# EAGLE design LPS25HBTR (EAGLE 9.0.0)
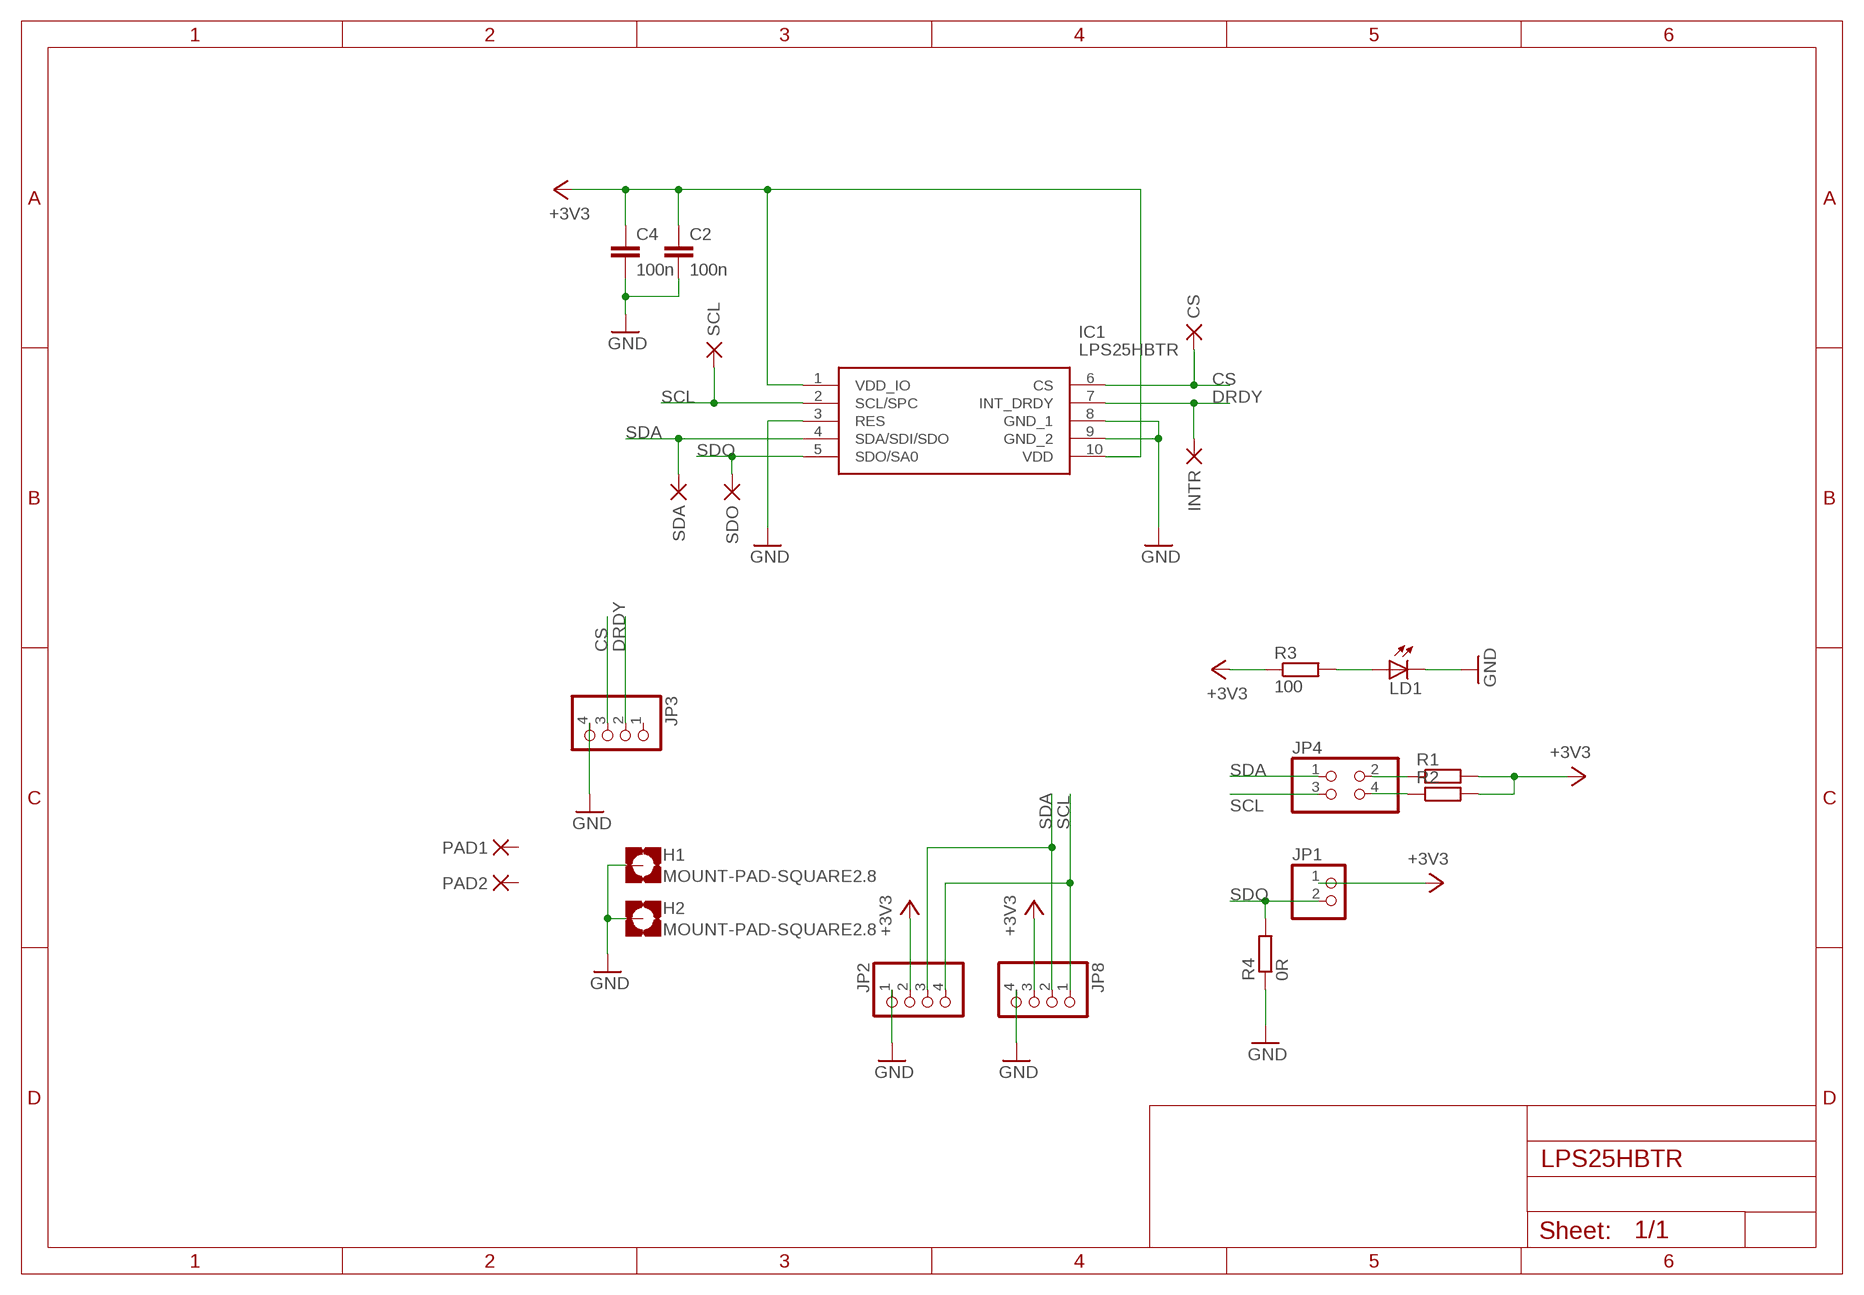
[diagram p0: schematic, sheet 1]

## Parts
C2  100n  C-EUC0805  [C0805]
C4  100n  C-EUC0805  [C0805]
CS  PAD-SMD10R  [SMD10R]
H1  MOUNT-PAD-SQUARE2.8  [2,8-PAD-SQUARE]
H2  MOUNT-PAD-SQUARE2.8  [2,8-PAD-SQUARE]
IC1  LPS25HBTR  [PQFN60P250X250X80-10N]
INTR  PAD-SMD10R  [SMD10R]
JP1  PINHD-1X2  [1X02]
JP2  PINHD-1X4_2.54-90°  [1X04/90]
JP3  PINHD-1X4  [1X04]
JP4  PINHD-2X2_2.54  [2X02]
JP8  PINHD-1X4_2.54-90°  [1X04/90]
LD1  LEDCHIPLED_0805  [CHIPLED_0805]
PAD1  PAD-SMD10R  [SMD10R]
PAD2  PAD-SMD10R  [SMD10R]
R1  R-EU_R0805  [R0805]
R2  R-EU_R0805  [R0805]
R3  100  R-EU_R0805  [R0805]
R4  0R  R-EU_R0805  [R0805]
SCL  PAD-SMD10R  [SMD10R]
SDA  PAD-SMD10R  [SMD10R]
SDO  PAD-SMD10R  [SMD10R]

## Nets
+3V3: C2.1 C4.1 IC1.1(VDD_IO) IC1.10(VDD) JP1.1 JP2.2 JP8.3 R1.2 R2.2 R3.1
CS: CS.PAD(P) IC1.6(CS) JP3.3
DRDY: IC1.7(INT_DRDY) INTR.PAD(P) JP3.2
GND: C2.2 C4.2 H1.B2,8(MOUNT) H2.B2,8(MOUNT) IC1.3(RES) IC1.8(GND_1) IC1.9(GND_2) JP2.1 JP3.4 JP8.4 LD1.C R4.1
N$1: JP4.2 R1.1
N$12: LD1.A R3.2
N$15: JP4.4 R2.1
SCL: IC1.2(SCL/SPC) JP2.4 JP4.3 JP8.1 SCL.PAD(P)
SDA: IC1.4(SDA/SDI/SDO) JP2.3 JP4.1 JP8.2 SDA.PAD(P)
SDO: IC1.5(SDO/SA0) JP1.2 R4.2 SDO.PAD(P)
Unconnected: JP3.1 PAD1.PAD(P) PAD2.PAD(P)

## Library data of the parts
C2 C4 = rcl:C-EU: CAPACITOR, European symbol
CS INTR PAD1 PAD2 SCL SDA SDO = dpads:PAD: WIRE PAD Standard US Drill Sizes and SMD pads
H1 H2 = holes:MOUNT-PAD-SQUARE: MOUNTING PAD, square
IC1 = LPS25HBTR:LPS25HBTR: Board Mount Pressure Sensors HESA MICROSYSTEM Source: Datasheet <http://www.st.com/st-web-ui/static/active/en/resource/technical/document/datasheet/DM00141379.pdf>; DESCRIPTION: Board Mount Pressure Sensors HESA MICROSYSTEM; HEIGHT: 0.8mm; MANUFACTURER_NAME: STMicroelectronics; MANUFACTURER_PART_NUMBER: LPS25HBTR; MOUSER_PART_NUMBER: 511-LPS25HBTR; MOUSER_PRICE-STOCK: https://www.mouser.com/Search/Refine.aspx?Keyword=511-LPS25HBTR; RS_PART_NUMBER: 1106550P; RS_PRICE-STOCK: http://uk.rs-online.com/web/p/products/1106550P
JP1 = pinhead:PINHD-1X2: PIN HEADER
JP2 JP8 = pinhead-1:PINHD-1X4: PIN HEADER
JP3 = pinhead:PINHD-1X4: PIN HEADER
JP4 = pinhead-1:PINHD-2X2: PIN HEADER
LD1 = led:LED: LED OSRAM: - CHIPLED LG R971, LG N971, LY N971, LG Q971, LY Q971, LO R971, LY R971 LH N974, LH R974 LS Q976, LO Q976, LY Q976 LO Q996 - Hyper CHIPLED LW Q18S LB Q993, LB Q99A, LB R99A - SideLED LS A670, LO A670, LY A670, LG A670, LP A670 LB A673, LV A673, LT A673, LW A673 LH A674 LY A675 LS A676, LA A676, LO A676, LY A676, LW A676 LS A679, LY A679, LG A679 - Hyper Micro SIDELED® LS Y876, LA Y876, LO Y876, LY Y876 LT Y87S - SmartLED LW L88C, LW L88S LB L89C, LB L89S, LG L890 LS L89K, LO L89K, LY L89K LS L896, LA L896, LO L896, LY L896 - TOPLED LS T670, LO T670, LY T670, LG T670, LP T670 LSG T670, LSP T670, LSY T670, LOP T670, LYG T670 LG T671, LOG T671, LSG T671 LB T673, LV T673, LT T673, LW T673 LH T674 LS T676, LA T676, LO T676, LY T676, LB T676, LH T676, LSB T676, LW T676 LB T67C, LV T67C, LT T67C, LS T67K, LO T67K, LY T67K, LW E67C LS E67B, LA E67B, LO E67B, LY E67B, LB E67C, LV E67C, LT E67C LW T67C LS T679, LY T679, LG T679 LS T770, LO T770, LY T770, LG T770, LP T770 LB T773, LV T773, LT T773, LW T773 LH T774 LS E675, LA E675, LY E675, LS T675 LS T776, LA T776, LO T776, LY T776, LB T776 LHGB T686 LT T68C, LB T68C - Hyper Mini TOPLED® LB M676 - Mini TOPLED Santana® LG M470 LS M47K, LO M47K, LY M47K Source: http://www.osram.convergy.de/
R1-R4 = rcl:R-EU_: RESISTOR, European symbol

## Board
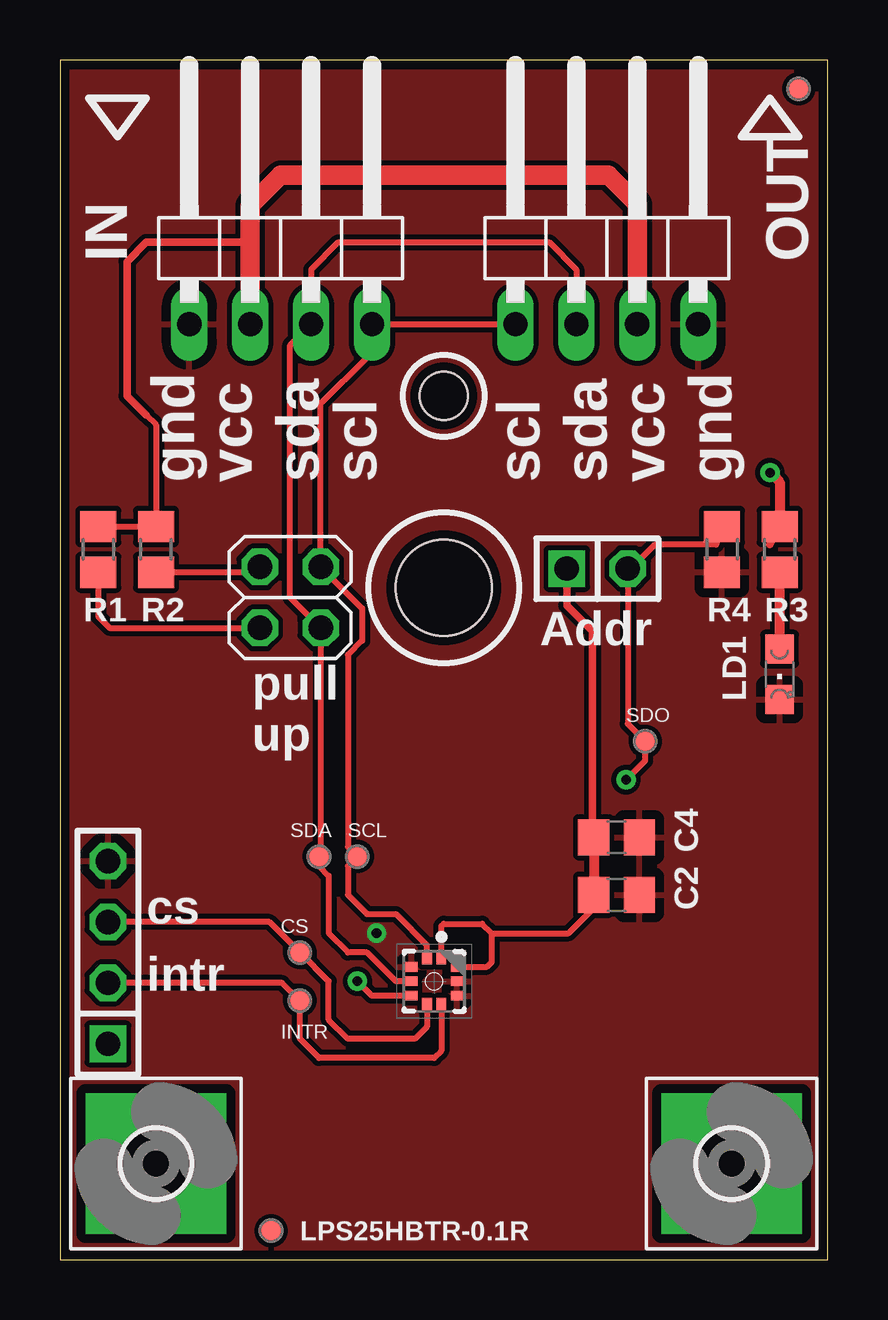
[diagram p1: board, top side]
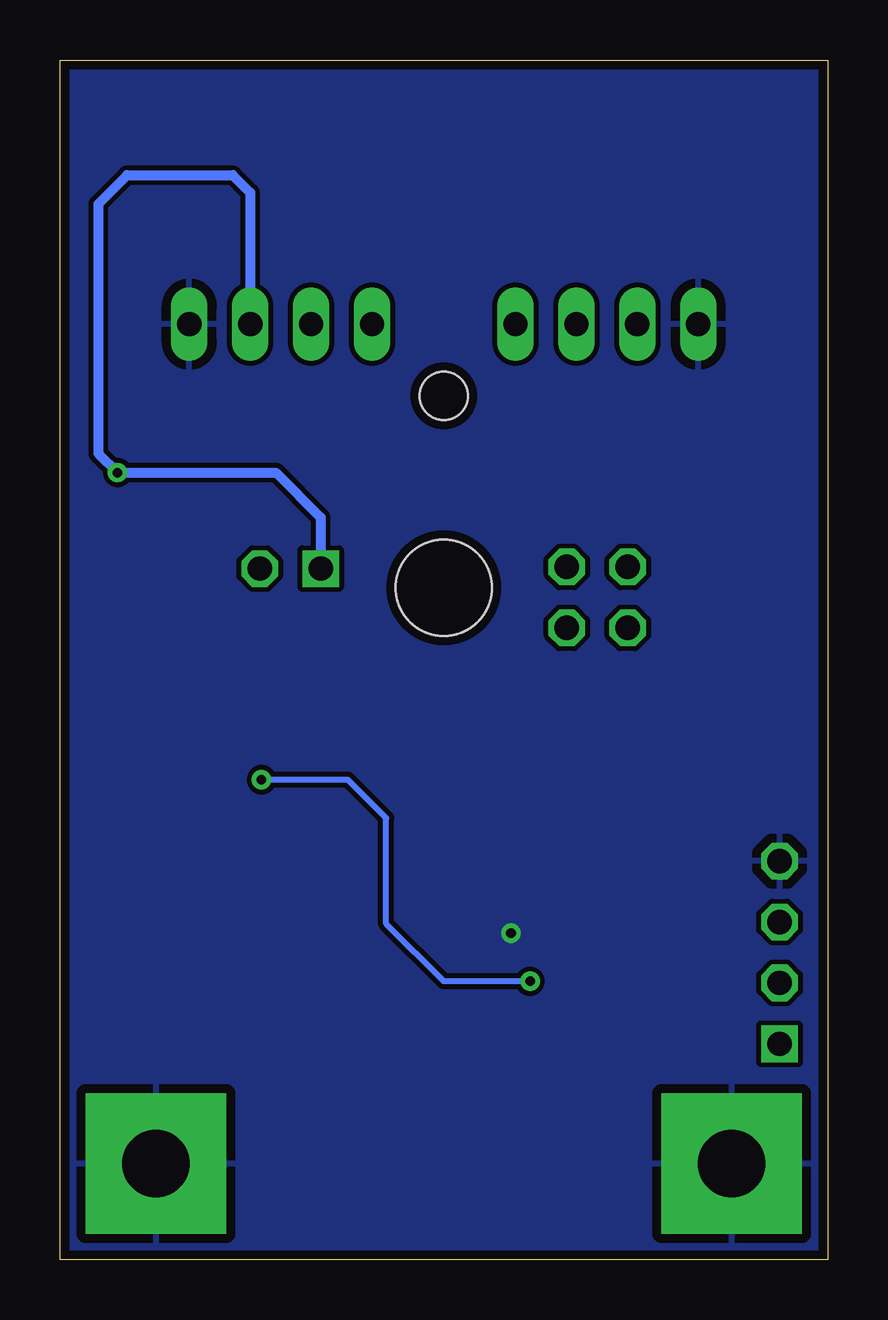
[diagram p2: board, bottom side, seen from below]

Size 32 x 50 mm. Coordinates in mm from the lower left corner, seen from the top.
Outline: 0,0 32,0 32,50 0,50 0,0
Copper layers (1*16): Top 0.035mm / dielectric 1.5mm / Bottom 0.035mm
Design rules "default *": minimum track width 10mil, minimum drill 0.6mm, track to track 8mil, track to pad 8mil, pad to pad 7mil, via to via 8mil, smd to smd 2mil, copper to edge 15mil, drill to drill 10mil, minimum pad ring 10mil, minimum via ring 8mil, stop-mask expansion 4mil, vias tented up to drill 0.6mm, thermal gap 15mil
Holes 2 mm at 16,36
Holes 4 mm at 16,28

### Footprints (pad centres in the part's own frame; a part is rotated, then mirrored left to right if it is on the bottom)
C0805 = smd 1.3 x 1.5: 1 -0.95,0; 2 0.95,0
SMD10R = smd 1 x 1: PAD 0,0
2,8-PAD-SQUARE = drill 2.8 pad 5.842 square: B2,8 0,0
PQFN60P250X250X80-10N = smd 0.5 x 0.4: 1 -0.95,0.3; 2 -0.95,-0.3; 6 0.95,-0.3; 7 0.95,0.3 | smd 0.4 x 0.5: 3 -0.6,-0.95; 4 0,-0.95; 5 0.6,-0.95; 8 0.6,0.95; 9 0,0.95; 10 -0.6,0.95
1X02 = drill 1.016 square: 1 -1.27,0 | drill 1.016 octagon: 2 1.27,0
1X04/90 = drill 1.016 long: 1 -3.81,-3.81; 2 -1.27,-3.81; 3 1.27,-3.81; 4 3.81,-3.81
1X04 = drill 1.016 square: 1 -3.81,0 | drill 1.016 octagon: 2 -1.27,0; 3 1.27,0; 4 3.81,0
2X02 = drill 1.016 octagon: 1 -1.27,-1.27; 2 -1.27,1.27; 3 1.27,-1.27; 4 1.27,1.27
CHIPLED_0805 = smd 1.2 x 1.2: A 0,-1.05; C 0,1.05
R0805 = smd 1.3 x 1.5: 1 -0.95,0; 2 0.95,0

### Placement (x,y rotation side)
C2  23.2,15.2 0 top
C4  23.2,17.6 0 top
CS  10,12.8 0 top
H1  4,4 0 top
H2  28,4 0 top
IC1  15.6,11.6 270 top
INTR  10,10.8 0 top
JP1  22.4,28.8 0 top
JP2  9.2,42.8 0 top
JP3  2,12.8 90 top
JP4  9.6,27.6 90 top
JP8  22.8,42.8 0 top
LD1  30,24.4 180 top
PAD1  8.8,1.2 0 top
PAD2  30.8,48.8 0 top
R1  1.6,29.6 90 top
R2  4,29.6 90 top
R3  30,29.6 270 top
R4  27.6,29.6 90 top
SCL  12.4,16.8 0 top
SDA  10.8,16.8 0 top
SDO  24.4,21.6 0 top

### Tracks (layer width: path | path; a pad name or v marks a point on that pad's centre or on a via)
+3V3  (via drill 0.4)
  Top 0.254: C2.1 22.13,15.13 | 22.13,15.13 22,15 | R1.2 R2.2 4,34.8 3.6,35.2 | IC1.1 15.9,13.9 16,14 17.6,14 18,13.6 | IC1.10 17.8,12.2 18,12.4 18,13.6 | 18,13.6 21.2,13.6 22.13,14.53 22.13,15.13
  Top 0.305: R3.1 29.6,29.8 | 3.6,35.2 2.8,36 2.8,41.6 3.6,42.4 7.93,42.4 | JP1.1 21.13,27.27 22.2,26.2 22.2,17.9 C4.1
  Top 0.406: C4.1 C2.1 | v29.6,32.8 30,32.4 R3.1
  Top 0.813: JP2.2 7.93,42.4 7.93,43.93 9.2,45.2 22.87,45.2 24.07,44 JP8.3
  Bottom 0.406: JP8.3 24.07,44.47 24.8,45.2 29.2,45.2 30.4,44 30.4,33.6 v29.6,32.8 23,32.8 21.13,30.93 JP1.1
CS
  Top 0.254: IC1.6 15.3,9.7 14.8,9.2 12,9.2 11.2,10 11.2,11.6 CS.PAD 8.73,14.07 JP3.3
DRDY
  Top 0.254: IC1.7 15.9,8.7 15.6,8.4 10.8,8.4 10,9.2 INTR.PAD 9.27,11.53 JP3.2
GND  (via drill 0.4)
  other vias: 13.2,13.6
  pour Top: -0.1,50 32.1,50.1 32.1,0.2 -0.1,0.1
  pour Bottom: 0,50 32,50 32,0 0,0
N$1
  Top 0.254: R1.1 1.6,26.8 2.07,26.33 JP4.2
  Top 0.305: R1.1 1.6,29.15
N$12
  Top 0.406: LD1.A R3.2
N$15
  Top 0.254: R2.1 8.11,28.65 JP4.4
  Top 0.305: R2.1 4.08,28.87
SCL
  Top 0.254: JP2.4 13.2,38.99 | 13.2,38.99 JP8.1 | 13.2,38.99 12.8,38.59 12.8,37.6 10.87,35.67 JP4.3 12.6,27.14 12.6,25.8 12,25.2 12,17.2 SCL.PAD 12,16.4 12,15.2 12.8,14.4 14,14.4 15.3,13.1 IC1.2
SDA
  Top 0.254: JP4.1 9.6,27.6 9.6,38.12 JP2.3 10.47,41.27 11.6,42.4 20.4,42.4 21.53,41.27 JP8.2 | JP4.1 10.8,26.26 | JP4.1 10.87,16.87 SDA.PAD 10.8,16.4 11.2,16 11.2,13.6 12,12.8 12.8,12.8 14,11.6 IC1.4
SDO  (via drill 0.4)
  Top 0.254: R4.2 27.35,29.8 24.8,29.8 23.8,28.8 JP1.2 23.67,22.33 SDO.PAD 24.4,20.8 v23.6,20 | IC1.5 13,11 v12.4,11.6
  Bottom 0.254: 23.6,28.73 JP1.2 | v12.4,11.6 16,11.6 18.4,14 18.4,18.4 20,20 v23.6,20

### Text on the board
tNames: IN | OUT | gnd | vcc | sda | scl | scl | sda | vcc | gnd | Addr | pull / up | cs | intr | LPS25HBTR-0.1R